# EAGLE design Lumiboard - sensor board (rev A) (EAGLE 6.2)
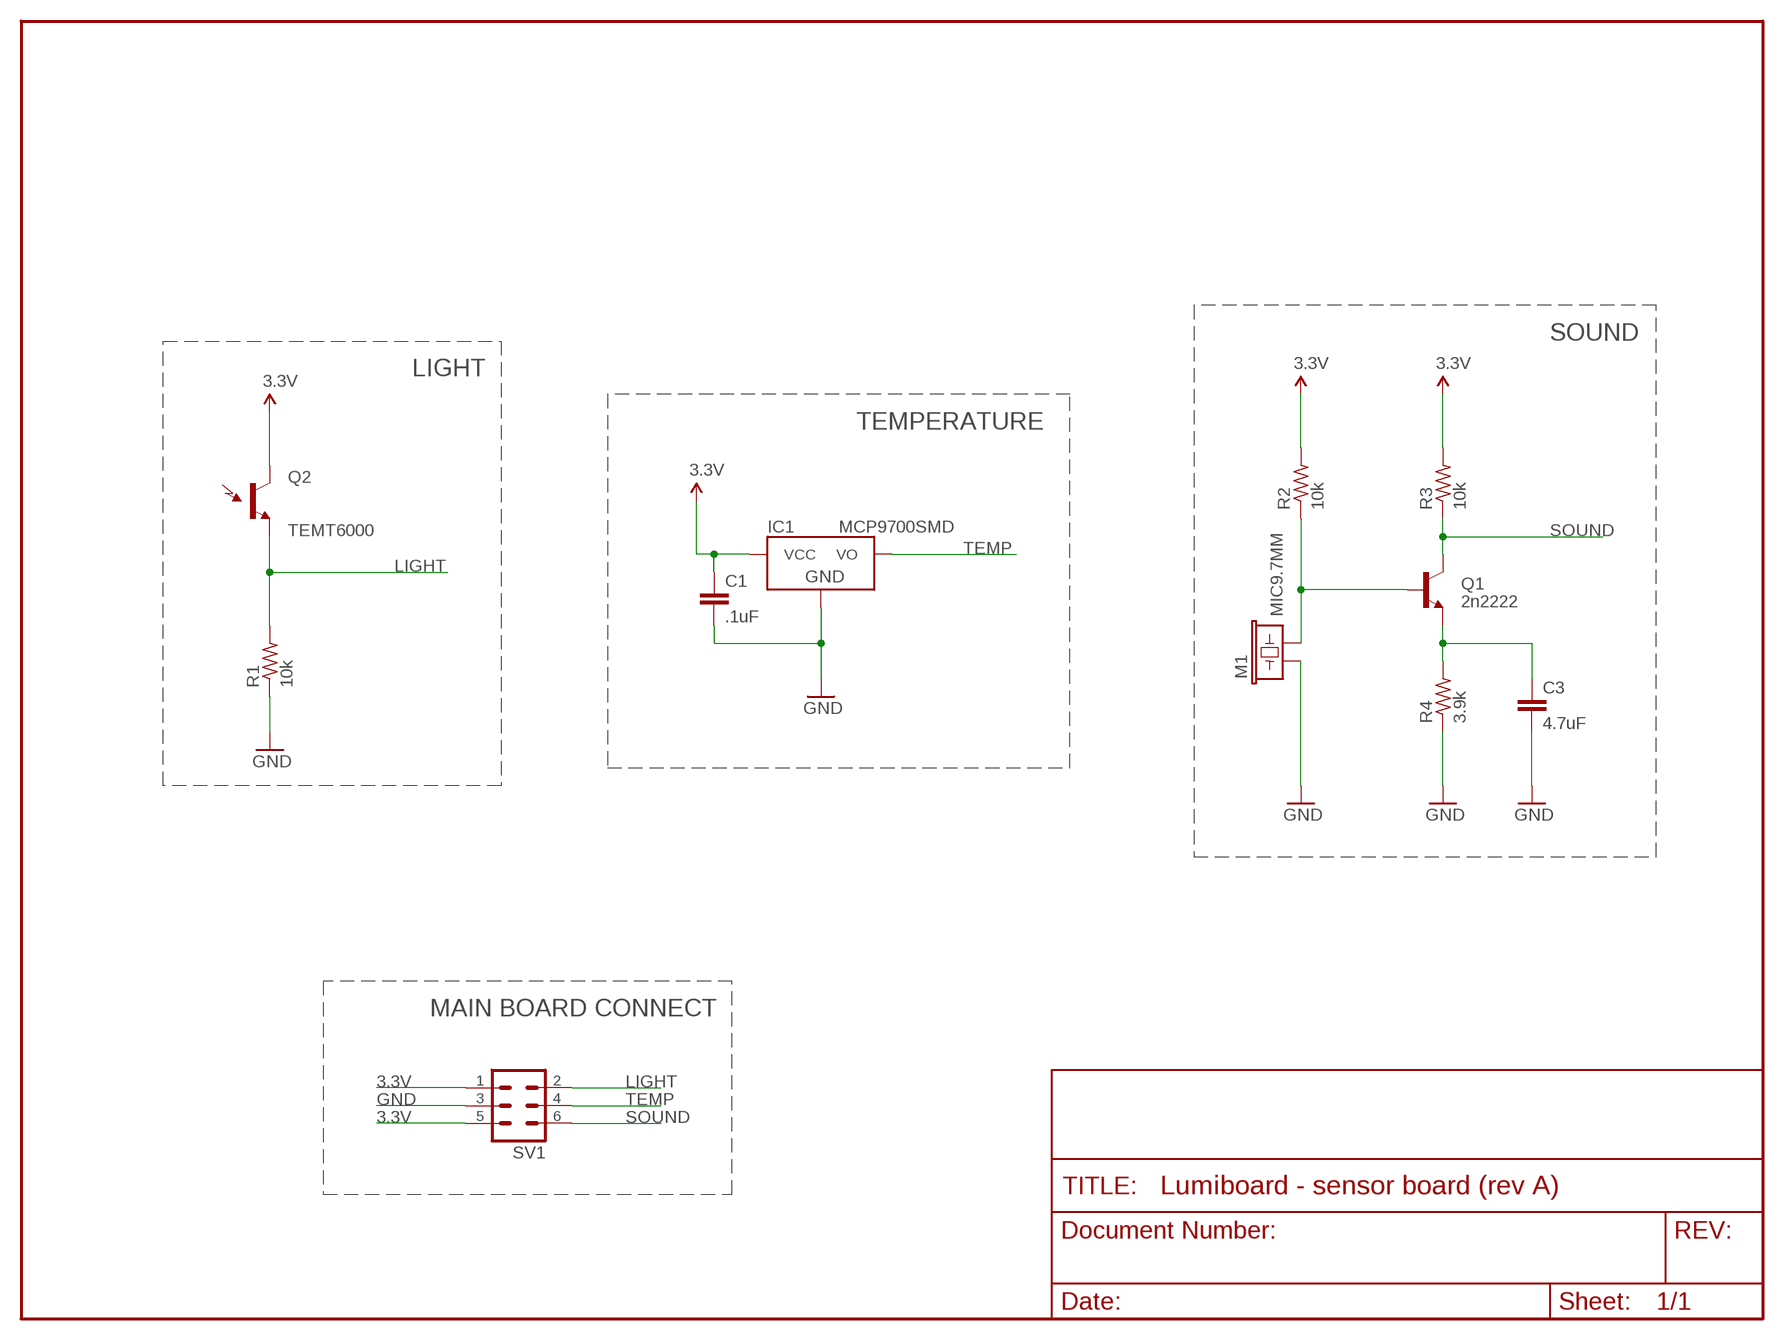
[diagram p0: schematic, sheet 1]

## Parts
C1  .1uF  CAP0805  [0805]
C3  4.7uF  CAP0805  [0805]
IC1  MCP9700SMD  [SOT23-3]
M1  MIC9.7MM  [MIC-9.7MM]
Q1  2n2222  TRANSISTOR_NPNSOT23-3  [SOT23-3]
Q2  TEMT6000  [TEMT6000-SEN]
R1  10k  R-US_R0805  [R0805]
R2  10k  R-US_R0805  [R0805]
R3  10k  R-US_R0805  [R0805]
R4  3.9k  R-US_R0805  [R0805]
SV1  ML6  [ML6]

## Nets
3.3V: C1.1 IC1.1(VCC) Q2.COLLECTOR(C1) R2.2 R3.2 SV1.1 SV1.5
GND: C1.2 C3.2 IC1.3(GND) M1.1 R1.1 R4.1 SV1.3
LIGHT: Q2.EMITTER(E1) R1.2 SV1.2
N$1: M1.2 Q1.1(B) R2.1
N$2: C3.1 Q1.2(E) R4.2
SOUND: Q1.3(C) R3.1 SV1.6
TEMP: IC1.2(VO) SV1.4

## Notes on the sheet
- SOUND
- LIGHT
- TEMPERATURE
- MAIN BOARD CONNECT

## Library data of the parts
C1 C3 = SparkFun:CAP: Capacitor Standard 0603 ceramic capacitor, and 0.1" leaded capacitor.
IC1 = SparkFun:MCP9700
M1 = SparkFun:MIC: Microphone Omni-directional electret microphone. 9.7mm standard diameter.
Q1 = SparkFun:TRANSISTOR_NPN: Transistor NPN BJT configuration in SOT23 package. MMBT2222 is the common NPN we use. Double check BCE configuration again layout.
Q2 = SparkFun:TEMT6000: Ambient Light Sensor Simple light detection sensor. Output varies with light intensity input. Spark Fun Electronics SKU : COM-08348
R1-R4 = resistor:R-US_: RESISTOR, American symbol
SV1 = con-harting-ml:ML6: HARTING; OC_FARNELL: unknown; OC_NEWARK: unknown

## Board
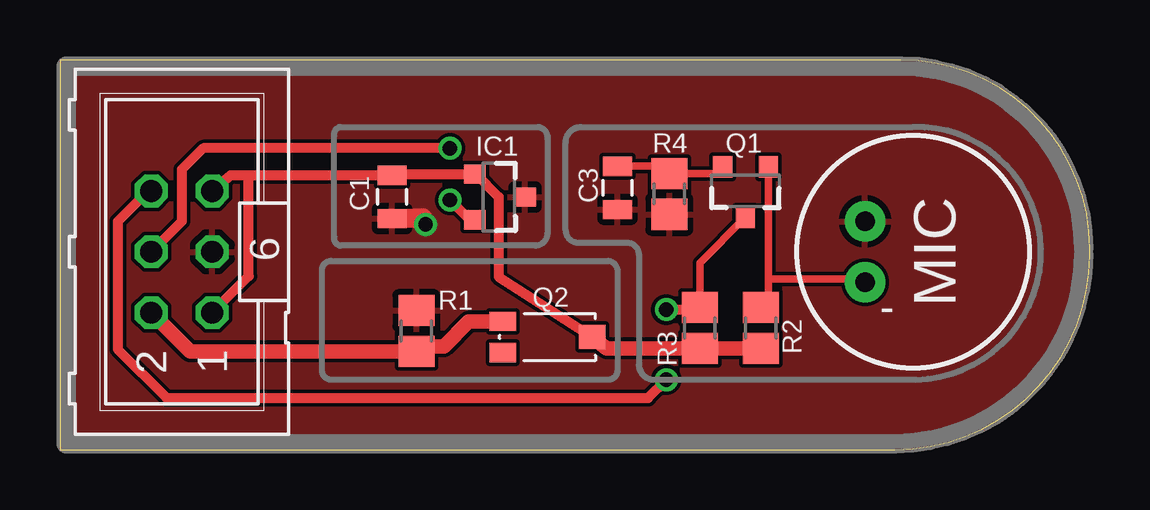
[diagram p1: board, top side]
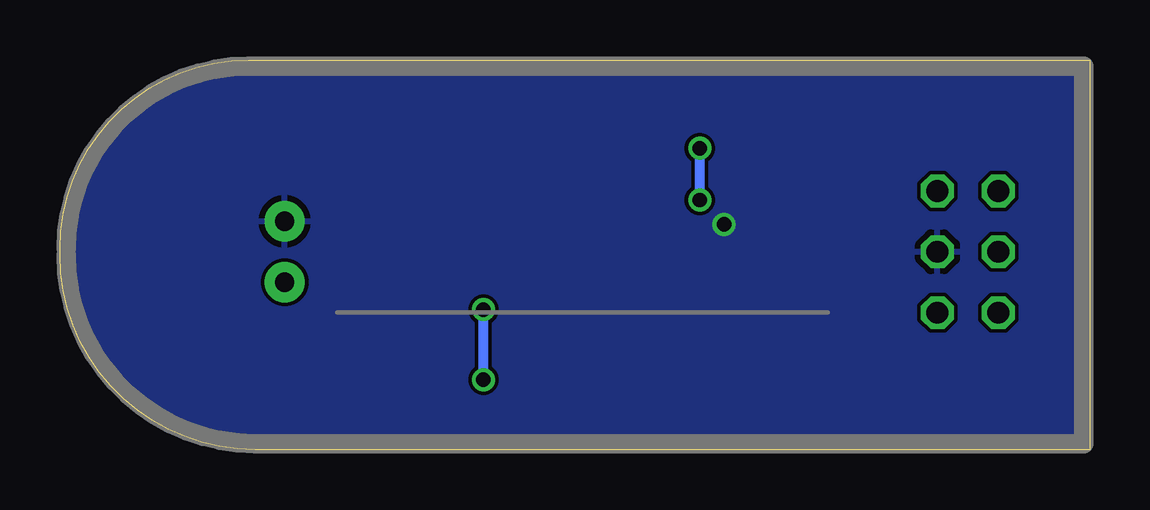
[diagram p2: board, bottom side, seen from below]

Size 42.93 x 16.26 mm. Coordinates in mm from the lower left corner, seen from the top.
Outline: 0,0 34.8,0 arc90 42.93,8.13 42.93,8.38 arc90 35.05,16.26 0,16.26 0,0
Copper layers (1*16): Top 0.0356mm / dielectric 1.5011mm / Bottom 0.0356mm
Design rules "LaenPCBOrder": minimum track width 6mil, minimum drill 13mil, track to track 6mil, track to pad 6mil, pad to pad 6mil, via to via 6mil, smd to smd 6mil, copper to edge 15mil, drill to drill 6mil, minimum pad ring 7mil, minimum via ring 7mil, stop-mask expansion 4mil, vias tented up to drill 0mil, thermal gap 10mil

### Footprints (pad centres in the part's own frame; a part is rotated, then mirrored left to right if it is on the bottom)
0805 = smd 0.8 x 1.2: 1 -0.9,0; 2 0.9,0
SOT23-3 = smd 0.8 x 0.9: 1 -0.95,-1; 2 0.95,-1; 3 0,1.1
MIC-9.7MM = drill 0.8 pad 1.676: 1 -2,1.27; 2 -2,-1.27
TEMT6000-SEN = smd 1.1 x 0.8: BASE -1.87,-0.65; EMITTER -1.87,0.65 | smd 1.1 x 1: COLLECTOR 1.86,0.01
R0805 = smd 1.3 x 1.5: 1 -0.85,0; 2 0.85,0
ML6 = drill 0.914 octagon: 1 -2.54,-1.27; 2 -2.54,1.27; 3 0,-1.27; 4 0,1.27; 5 2.54,-1.27; 6 2.54,1.27

### Placement (x,y rotation side)
C1  13.84,10.54 270 top
C3  23.24,10.92 270 top
IC1  18.29,10.54 270 top
M1  35.56,8.26 0 top
Q1  28.57,10.79 180 top
Q2  20.32,4.7 0 top
R1  14.86,4.95 270 top
R2  29.21,5.08 270 top
R3  26.67,5.08 270 top
R4  25.4,10.67 90 top
SV1  5.08,8.26 90 top

### Tracks (layer width: path | path; a pad name or v marks a point on that pad's centre or on a via)
3.3V
  Top 0.406: Q2.COLLECTOR 18.29,7.2 18.29,10.54 17.34,11.49 IC1.1 13.89,11.49 C1.1 7.87,11.44 | 7.87,11.44 7.11,11.44 SV1.5 | SV1.1 7.87,7.24 7.87,11.44
  Top 0.61: R2.2 R3.2 22.79,4.23 Q2.COLLECTOR
GND  (via drill 0.6)
  Top 0.813: C1.2 15.11,9.65 v15.24,9.4
  pour Bottom: -0.25,-0.25 33.53,-0.25 arc90 43.18,7.37 43.18,8.38 arc90 35.05,16.51 -0.25,16.51
  pour Top: -0.25,-0.25 33.53,-0.25 34.8,-0.25 arc90 43.18,8.13 43.18,8.38 arc90 35.05,16.51 -0.25,16.51
LIGHT
  Top 0.61: Q2.EMITTER 17.03,5.35 16,4.32 15.07,4.32 R1.2 5.42,4.1 SV1.2
N$1
  Top 0.305: R2.1 29.52,6.25 29.52,7.11 | 29.52,7.11 Q1.1 | M1.2 33.43,7.11 29.52,7.11
N$2
  Top 0.305: C3.1 25.4,11.82 R4.2 27.62,11.52 Q1.2
SOUND  (via drill 0.6 pad 0.41)
  Top 0.305: Q1.3 26.67,7.79 R3.1
  Top 0.406: SV1.6 3.68,10.79 2.41,9.53 2.41,4.19 4.45,2.16 24.51,2.16 v25.27,2.92 | v25.27,5.84 26.58,5.84 R3.1
  Bottom 0.406: v25.27,2.92 v25.27,5.84
TEMP  (via drill 0.6 pad 0.41)
  Top 0.406: IC1.2 17.08,9.59 v16.26,10.41 | v16.26,12.57 5.97,12.57 5.08,11.68 5.08,9.53 SV1.4
  Bottom 0.406: v16.26,10.41 v16.26,12.57

### Text on the board
tNames: MIC
tDocu: TEMPERATURE | SOUND | LIGHT
bDocu: LUMIBOARD | SENSOR BOARD | REV A | Designed by Jason Webb